# EAGLE design Gimble_Breakout (EAGLE 6.6.0)
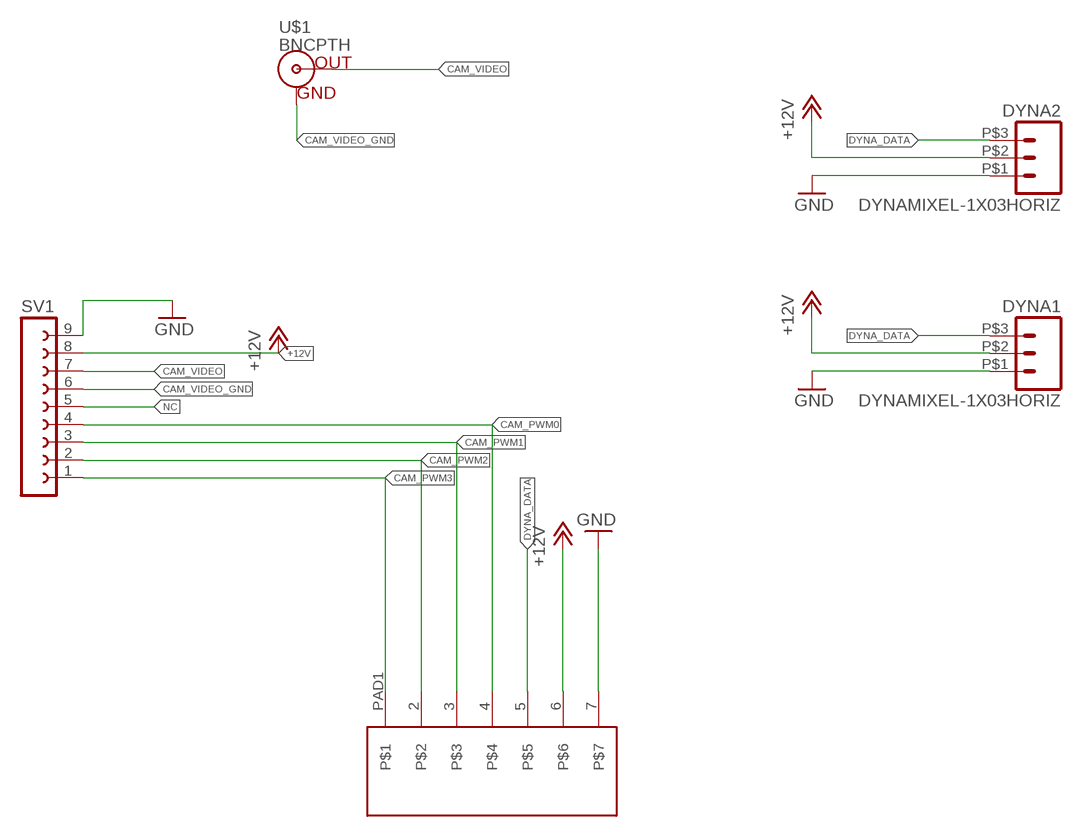
[diagram p0: schematic, sheet 1]

## Parts
DYNA1  DYNAMIXEL-1X03HORIZ  [MLX-SPOX5268-3PIN]
DYNA2  DYNAMIXEL-1X03HORIZ  [MLX-SPOX5268-3PIN]
SV1  FE09W  [FE09W]
U$1  BNCPTH  [BNC]
U$2  MOLEX7-PIN  [MOLEX7PIN]

## Nets
+12V: DYNA1.P$2 DYNA2.P$2 SV1.8 U$2.6
CAM_PWM0: SV1.4 U$2.4
CAM_PWM1: SV1.3 U$2.3
CAM_PWM2: SV1.2 U$2.2
CAM_PWM3: SV1.1 U$2.PAD1
CAM_VIDEO: SV1.7 U$1.S(OUT)
CAM_VIDEO_GND: SV1.6 U$1.GND
DYNA_DATA: DYNA1.P$3 DYNA2.P$3 U$2.5
GND: DYNA1.P$1 DYNA2.P$1 SV1.9 U$2.7
NC: SV1.5

## Library data of the parts
DYNA1 DYNA2 = MRDT-2015-Arm:DYNAMIXEL-1X03; MFR: Molex; MFR_PN: 0022057035; ORIENT: Horiz
SV1 = con-lsta:FE09W: FEMALE HEADER; OC_FARNELL: unknown; OC_NEWARK: unknown
U$1 = SparkFun-Connectors:BNC: BNC Connector, Mouser Part# 5227161
U$2 = logicShifter:MOLEX7-PIN; TEST: 1

## Board
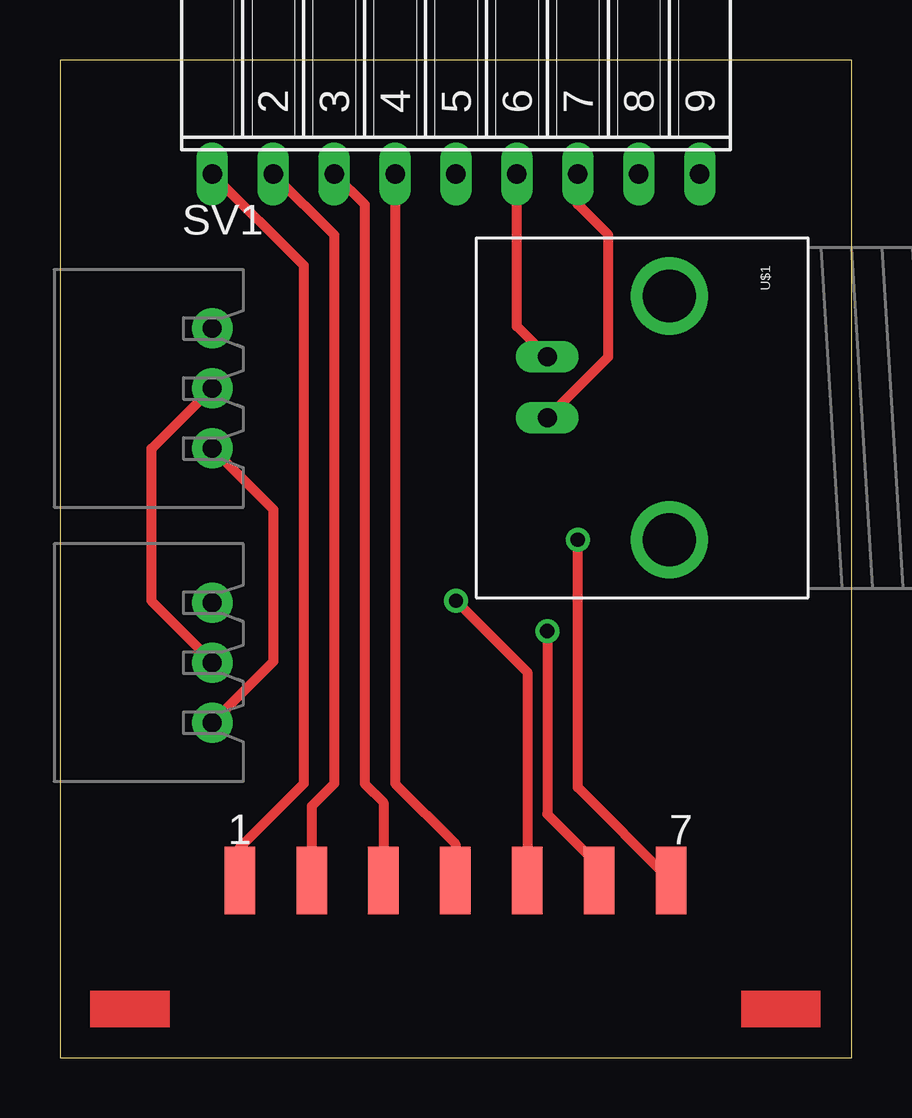
[diagram p1: board, top side]
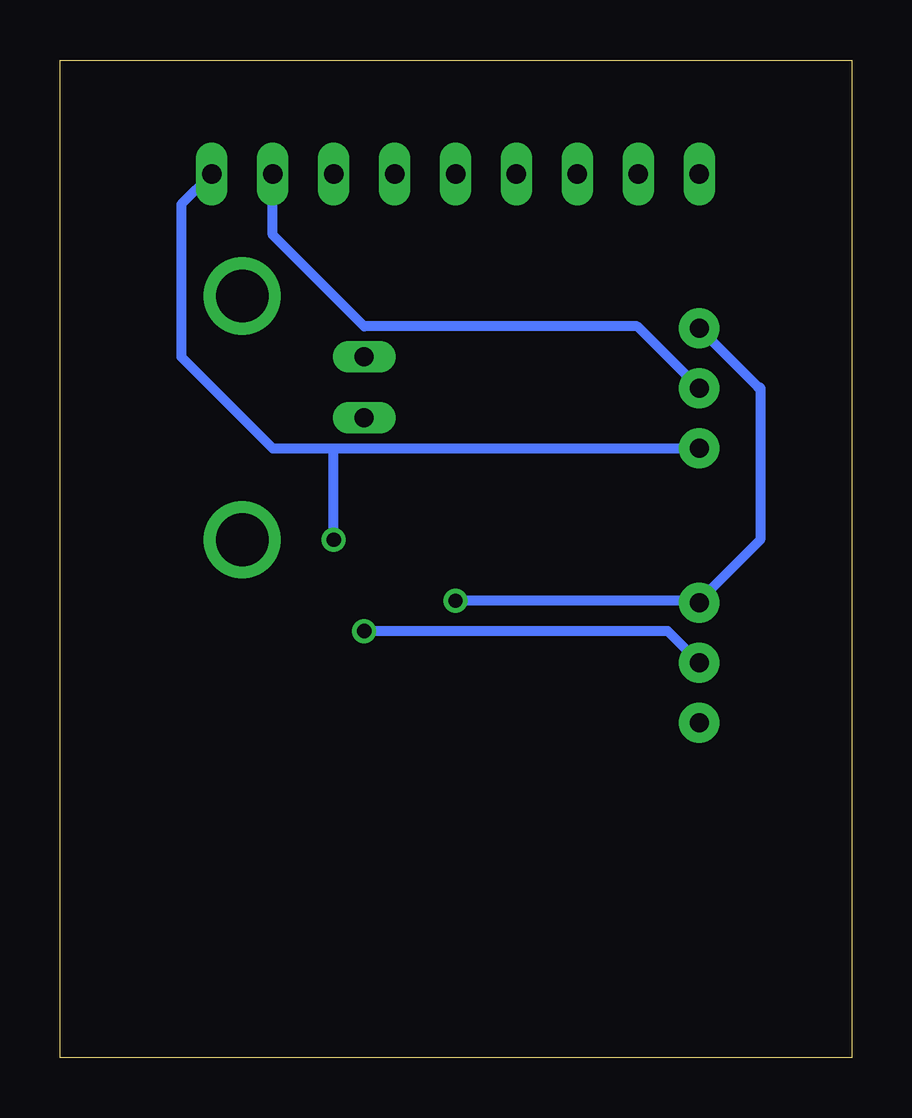
[diagram p2: board, bottom side, seen from below]

Size 33 x 41.58 mm. Coordinates in mm from the lower left corner, seen from the top.
Outline: 0,0 33,0 33,41.58 0,41.58 0,0
Copper layers (1*16): Top 0.035mm / dielectric 1.5mm / Bottom 0.035mm
Design rules "default": minimum track width 10mil, minimum drill 24mil, track to track 8mil, track to pad 8mil, pad to pad 8mil, via to via 8mil, smd to smd 8mil, copper to edge 40mil, drill to drill 8mil, minimum pad ring 10mil, minimum via ring 8mil, stop-mask expansion 4mil, vias tented up to drill 0mil, thermal gap 10mil

### Footprints (pad centres in the part's own frame; a part is rotated, then mirrored left to right if it is on the bottom)
MLX-SPOX5268-3PIN = drill 0.8 pad 1.676: P$1 0,0; P$2 2.5,0; P$3 5,0
FE09W = drill 0.813 long: 1 -10.16,0; 2 -7.62,0; 3 -5.08,0; 4 -2.54,0; 5 0,0; 6 2.54,0; 7 5.08,0; 8 7.62,0; 9 10.16,0
BNC = drill 2.2: 3 -5.08,5.08; 4 5.08,5.08 | drill 0.8 long: GND -2.54,0; S 0,0
MOLEX7PIN = smd 1.27 x 2.794: 2 9.22,6.121; 3 12.217,6.121; 4 15.215,6.121; 5 18.212,6.121; 6 21.209,6.121; 7 24.206,6.121; PAD1 6.223,6.121

### Placement (x,y rotation side)
DYNA1  6.35,13.97 90 top
DYNA2  6.35,25.4 90 top
SV1  16.51,36.83 0 top
U$1  20.32,26.67 270 top
U$2  1.27,1.27 0 top

### Tracks (layer width: path | path; a pad name or v marks a point on that pad's centre or on a via)
+12V  (via drill 0.6)
  Top 0.406: DYNA2.P$2 3.85,25.4 3.81,25.4 3.81,19.05 6.35,16.51 DYNA1.P$2 | v20.32,17.78 20.32,10.16 22.48,8 U$2.6
  Bottom 0.406: DYNA2.P$2 8.93,30.48 20.32,30.48 24.13,34.29 SV1.8 | DYNA1.P$2 7.66,17.78 v20.32,17.78
CAM_PWM0
  Top 0.406: SV1.4 13.97,11.43 16.48,8.91 U$2.4
CAM_PWM1
  Top 0.406: SV1.3 12.7,35.56 12.7,11.43 13.49,10.64 U$2.3
CAM_PWM2
  Top 0.406: SV1.2 11.43,34.29 11.43,11.43 10.49,10.49 U$2.2
CAM_PWM3
  Top 0.406: SV1.1 10.16,33.02 10.16,11.43 7.49,8.76 U$2.PAD1
CAM_VIDEO
  Top 0.406: U$1.S 22.86,29.21 22.86,34.29 21.59,35.56 SV1.7
CAM_VIDEO_GND
  Top 0.406: U$1.GND 19.05,30.48 SV1.6
DYNA_DATA  (via drill 0.6)
  Top 0.406: v16.51,19.05 19.48,16.08 U$2.5
  Bottom 0.406: DYNA2.P$3 3.89,27.94 3.81,27.94 3.81,21.59 6.35,19.05 DYNA1.P$3 6.43,19.05 v16.51,19.05
GND  (via drill 0.6)
  Top 0.406: DYNA2.P$1 8.89,22.86 8.89,16.51 DYNA1.P$1 | U$2.7 21.59,11.28 v21.59,21.59
  Bottom 0.406: SV1.9 27.94,35.56 27.94,29.21 24.13,25.4 21.59,25.4 | 21.59,25.4 DYNA2.P$1 | v21.59,21.59 21.59,25.4